# Altium schematic sheet Schematic.SchDoc
size A4; Author: Wojciech Zieliński; CompanyName: Akademia Górniczo-Hutnicza w Krakowie; Revision: 1; SheetNumber: 1; SheetTotal: 1; ProjectName: Elektroniczny miernik współczynnika THD sygnałów napięciowych
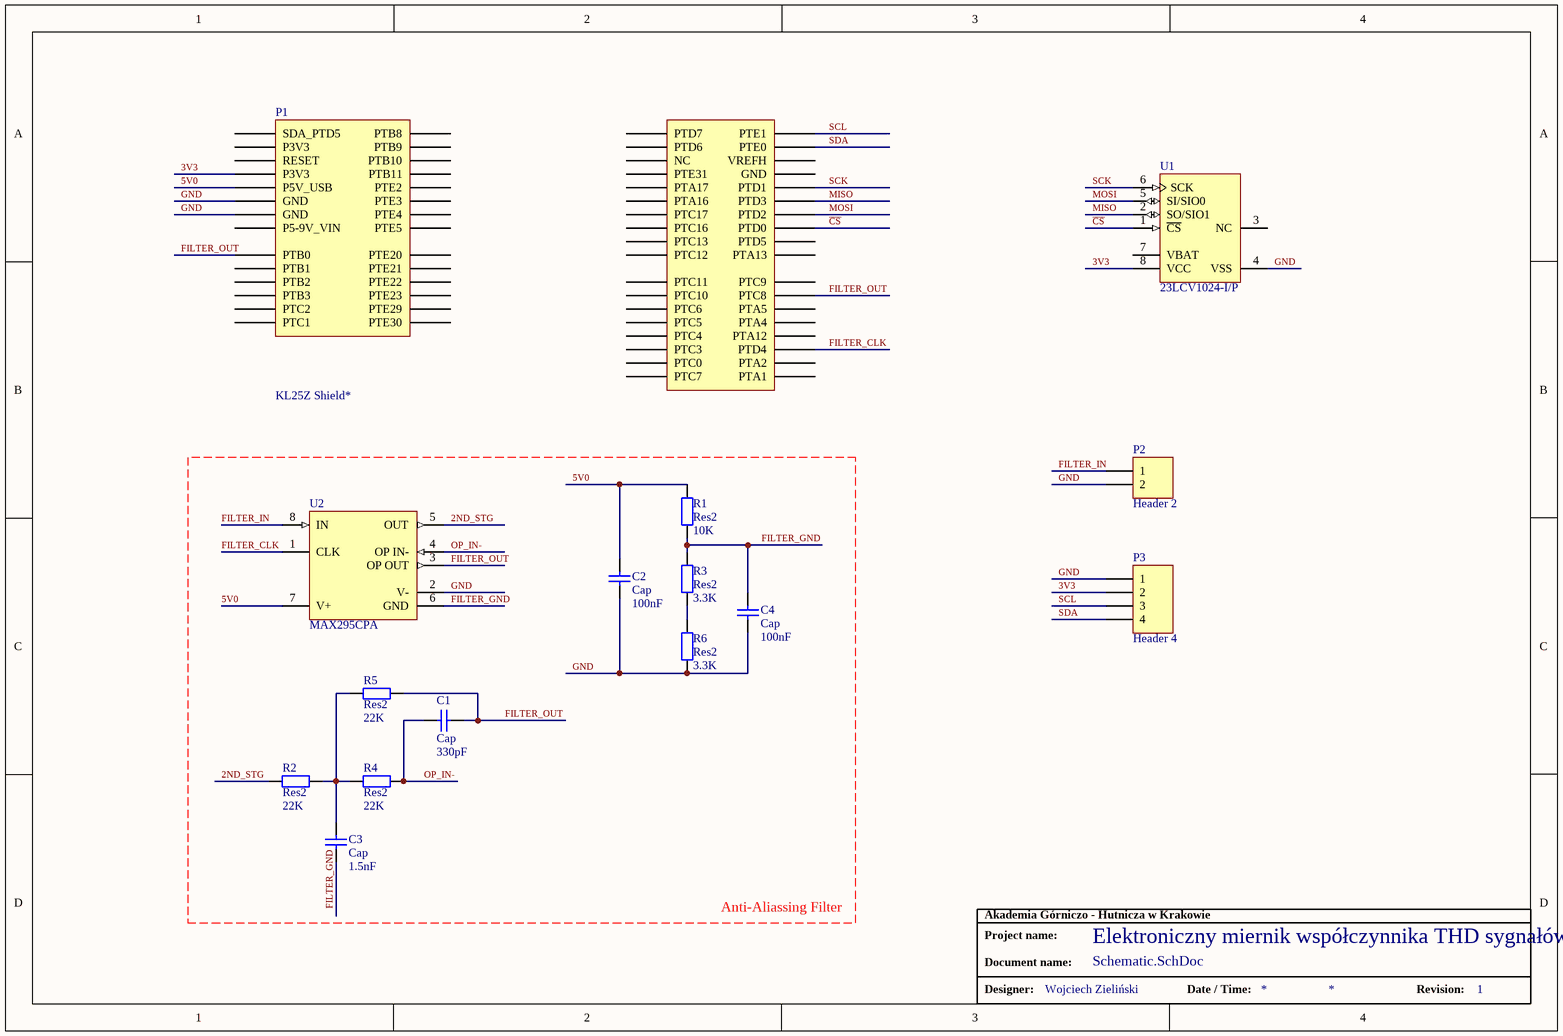
[diagram p0: Schematic.SchDoc]

## Parts
C1  Cap  value 330pF  [RAD-0.1]
C2  Cap  value 100nF  [RAD-0.1]
C3  Cap  value 1.5nF  [RAD-0.1]
C4  Cap  value 100nF  [RAD-0.1]
P1  KL25Z Shield*  [Freedom KL25Z Headerarray]
P2  Header 2  [HDR1X2]
P3  Header 4  [HDR1X4]
R1  Res2  value 10K  [AXIAL-0.4]
R2  Res2  value 22K  [AXIAL-0.4]
R3  Res2  value 3.3K  [AXIAL-0.4]
R4  Res2  value 22K  [AXIAL-0.4]
R5  Res2  value 22K  [AXIAL-0.4]
R6  Res2  value 3.3K  [AXIAL-0.4]
U1  23LCV1024-I/P  [MCHP-PDIP-P8]
U2  MAX295CPA  [MAXM-P8-2]

## Nets
2ND_STG: R2.1 U2.5(OUT)
3V3: P1.7(P3V3) P3.2 U1.8(VCC)
5V0: C2.2 P1.9(P5V_USB) R1.2 U2.7(V+)
~{CS}: P1.44(PTD0) U1.1(~{CS})
FILTER_CLK: P1.60(PTD4) U2.1(CLK)
FILTER_GND: C3.1 C4.2 R1.1 R3.2 U2.6(GND)
FILTER_IN: P2.1 U2.8(IN)
FILTER_OUT: C1.2 P1.17(PTB0) P1.52(PTC8) R5.2 U2.3(OP_OUT)
GND: C2.1 C4.1 P1.11(GND) P1.13(GND) P2.2 P3.1 R6.1 U1.4(VSS) U2.2(V-)
MISO: P1.40(PTD3) U1.2(SO/SIO1)
MOSI: P1.42(PTD2) U1.5(SI/SIO0)
OP_IN-: C1.1 R4.2 U2.4(OP_IN-)
SCK: P1.38(PTD1) U1.6(SCK)
SCL: P1.30(PTE1) P3.3
SDA: P1.32(PTE0) P3.4
NetC3_2: C3.2 R2.2 R4.1 R5.1
NetR3_1: R3.1 R6.2

Not connected (* = marked no-connect by the designer): P1 1(SDA_PTD5) 2(PTB8) 3(P3V3) 4(PTB9) 5(RESET) 6(PTB10) 8(PTB11) 10(PTE2) 12(PTE3) 14(PTE4) 15(P5-9V_VIN) 16(PTE5) 18(PTE20) 19(PTB1) 20(PTE21) 21(PTB2) 22(PTE22) 23(PTB3) 24(PTE23) 25(PTC2) 26(PTE29) 27(PTC1) 28(PTE30) 29(PTD7) 31(PTD6) 33(NC) 34(VREFH) 35(PTE31) 36(GND) 37(PTA17) 39(PTA16) 41(PTC17) 43(PTC16) 45(PTC13) 46(PTD5) 47(PTC12) 48(PTA13) 49(PTC11) 50(PTC9) 51(PTC10) 53(PTC6) 54(PTA5) 55(PTC5) 56(PTA4) 57(PTC4) 58(PTA12) 59(PTC3) 61(PTC0) 62(PTA2) 63(PTC7) 64(PTA1); U1 3(NC) 7(VBAT)

## Notes on the sheet
- Anti-Aliassing Filter
- Akademia Górniczo - Hutnicza w Krakowie
- Project name:
- Document name:
- Designer:
- Date / Time:
- Revision:

## Library data of the parts
C1-C4 = Cap: Capacitor; Published: 8-Jun-2000; LatestRevisionDate: 17-Jul-2002; LatestRevisionNote: Re-released for DXP Platform.; PackageReference: RAD-0.3; Publisher: Altium Limited; PackageDescription: Radial Cap, Thru-Hole; 2 Leads; 0.3 in Pin Spacing
P1 = Freedom KL25Z Header: FRDM KL25Z Shield
P2 = Header 2: Header, 2-Pin; LatestRevisionDate: 17-Jul-2002; LatestRevisionNote: Re-released for DXP Platform.; Publisher: Altium Limited
P3 = Header 4: Header, 4-Pin; LatestRevisionDate: 17-Jul-2002; LatestRevisionNote: Re-released for DXP Platform.; Publisher: Altium Limited
R1-R6 = Res2: Resistor; Published: 8-Jun-2000; LatestRevisionDate: 17-Jul-2002; LatestRevisionNote: Re-released for DXP Platform.; PackageReference: AXIAL-0.4; Publisher: Altium Limited; PackageDescription: Axial Device, Thru-Hole; 2 Leads; 0.4 in Pin Spacing
U1 = 23LCV1024-I/P: 1024K bits SPI Serial SRAM with Battery Backup and SDI Interface, 2.5 to 5.5 V, 20 MHz, -40 to 85 degC, 8-pin PDIP (P8), Tube; Manufacturer: Microchip; DatasheetVersion: Rev. A; PackageVersion: C04-018B; PackageReference: PDIP-P8; PackageDescription: 8-Pin Plastic Dual In-Line, Row Spacing 7.62 mm, 9.5 x 6.6 mm Body, 2.54 mm Pitch; Supplier 1: Digi-Key; Supplier Part Number 1: 23LCV1024-I/P-ND; Supplier 2: Newark; Supplier Part Number 2: 94T8210; Supplier 3: Mouser; Supplier Part Number 3: 579-23LCV1024-I/P; Mounting Technology: Through Hole; PartNumber: 23LCV1024-I/P; ComponentLink1Description: Manufacturer URL; ComponentLink1URL: http://www.microchip.com; ComponentLink2Description: Datasheet; ComponentLink2URL: http://ww1.microchip.com/downloads/en/DeviceDoc/25156A.pdf; ComponentLink3Description: Package Specification; ComponentLink3URL: http://www.microchip.com/stellent/groups/techpub_sg/documents/packagingspec/en012702.pdf; ComponentLink4Description: Product URL; ComponentLink4URL: http://www.microchip.com/23LCV1024
U2 = MAX295CPA: 8th-Order Switched Capacitor Lowpass Filter, Butterworth, Clock Tunable, 0 to 70 degC, 8-Pin DIP (P8-2); Generic Part Number: MAX295; Filter Sections: 1; Order Per Filter Section: 8; DatasheetVersion: Rev. 5; PackageVersion: Rev. E, 04/2011; PackageReference: P8-2; PackageDescription: 8-Pin Plastic Dual-In-Line, Narrow (0.3in) (P8-2), Body 9.375 x 6.985 mm, Pitch 2.54 mm; Supplier 1: Mouser; Supplier Part Number 1: N/A; Filter Characteristic: Butterworth; Filter Class: Switched Cap; Filter Type: Lowpass; Program Method: Clock; Mounting Technology: Through Hole; Code_JEDEC: MS001-XX; PartNumber: MAX295CPA; ComponentLink1Description: Manufacturer URL; ComponentLink1URL: http://www.maximintegrated.com/; ComponentLink2Description: Datasheet; ComponentLink2URL: http://datasheets.maximintegrated.com/en/ds/MAX291-MAX296.pdf; ComponentLink3Description: Package Specification; ComponentLink3URL: http://pdfserv.maximintegrated.com/package_dwgs/21-0043.PDF